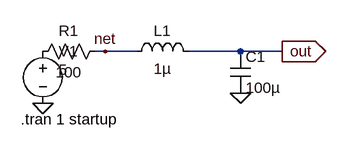
[diagram p0: schematic Draft1.asc]
Draft1.asc, the LTspice schematic file:
Version 4
SHEET 1 880 680
WIRE 240 48 224 48
WIRE 288 48 240 48
WIRE 448 48 368 48
WIRE 512 48 448 48
FLAG 448 112 0
FLAG 240 48 net
FLAG 512 48 out
IOPIN 512 48 Out
FLAG 144 128 0
SYMBOL res 240 32 R90
WINDOW 0 0 56 VBottom 2
WINDOW 3 32 56 VTop 2
SYMATTR InstName R1
SYMATTR Value 100
SYMATTR SpiceLine tol=0 pwr=0
SYMBOL ind 272 64 R270
WINDOW 0 32 56 VTop 2
WINDOW 3 5 56 VBottom 2
SYMATTR InstName L1
SYMATTR Value 1µ
SYMBOL cap 432 48 R0
SYMATTR InstName C1
SYMATTR Value 100µ
SYMBOL voltage 144 32 R0
WINDOW 3 24 44 Left 2
WINDOW 123 0 0 Left 0
WINDOW 39 0 0 Left 0
SYMATTR InstName V1
SYMATTR Value 5
TEXT 110 152 Left 2 !.tran 1 startup

The netlist it stands for:
* Draft1.asc
R1 net P001 100 tol=0 pwr=0
L1 net out 1µ
C1 out 0 100µ
V1 P001 0 5
.tran 1 startup
.backanno
.end

* Results of the author's LTspice run, read from the files saved beside the schematic
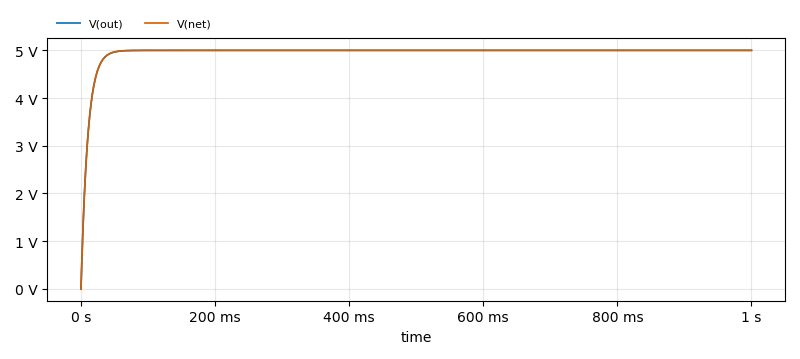
[diagram p1: Transient Analysis of Draft1.asc, plotted from the saved traces]
* Transient Analysis, 1 run:
*   V(out): min 0 V, max 5 V, average 4.95 V, rms 4.962 V, last 5 V
*   V(net): min 0 V, max 5 V, average 4.95 V, rms 4.962 V, last 5 V